# Altium schematic sheet reefpi_pico_toplevel.SchDoc: reef-pi Pico Top Level
size A4; DrawnBy: Yann Ramin; DocumentNumber: 1; Revision: D; SheetNumber: 1; SheetTotal: 8
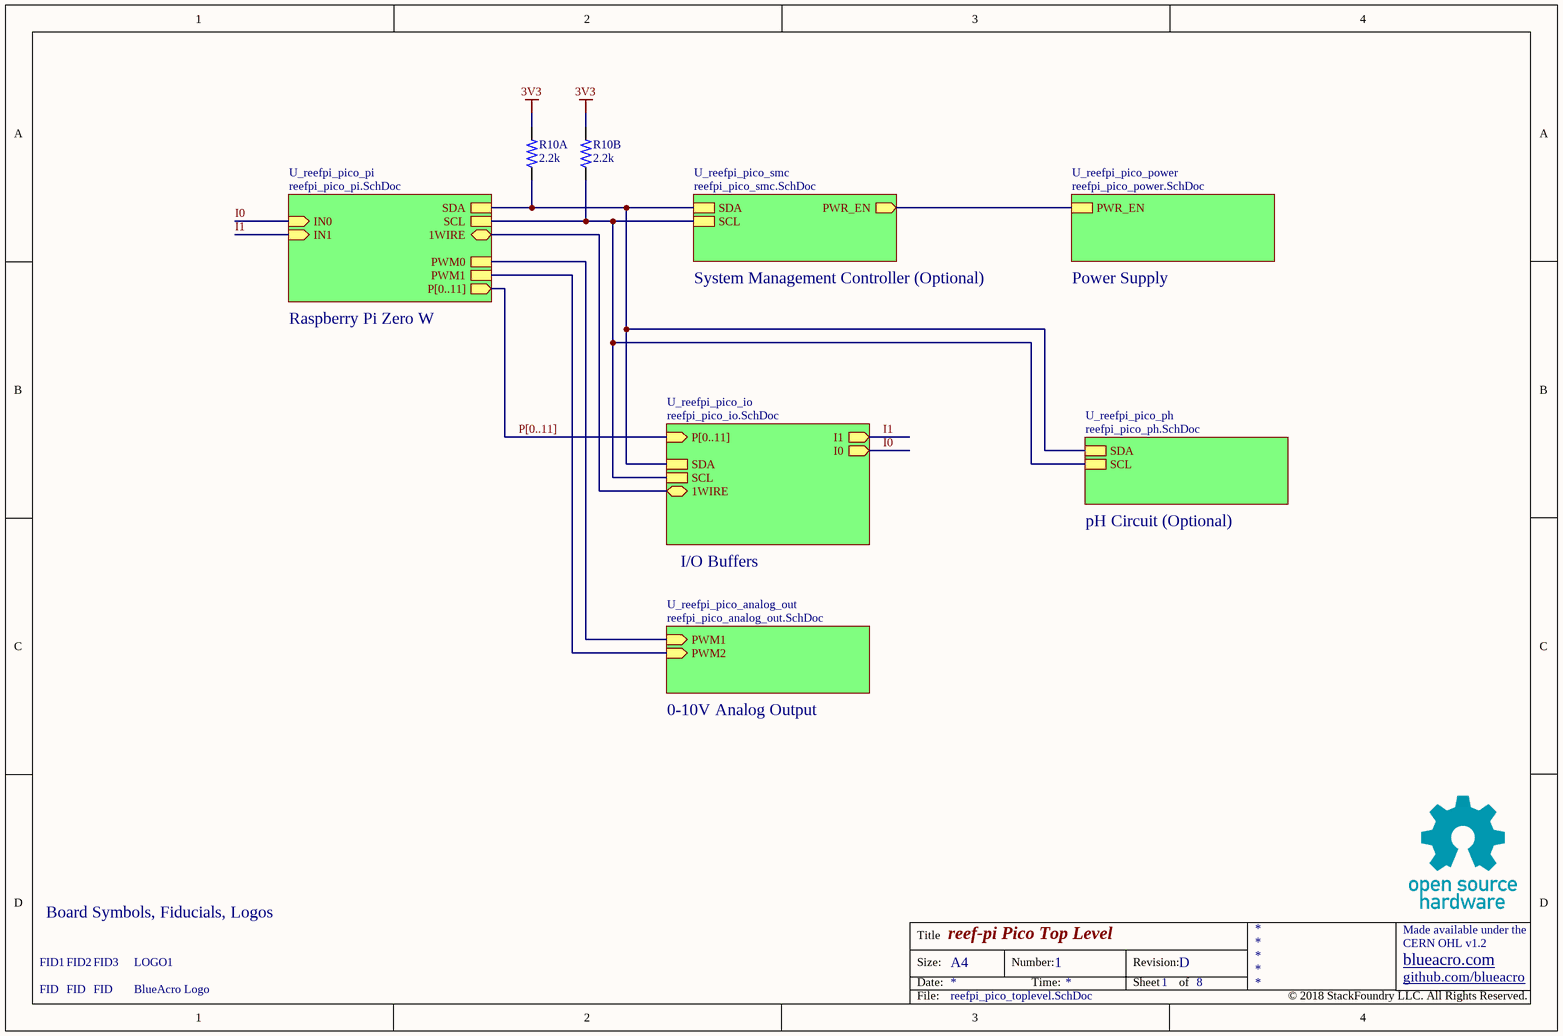
[diagram p0: reefpi_pico_toplevel.SchDoc]

## Parts
FID1  FID  [FIDUCIAL_1MM]
FID2  FID  [FIDUCIAL_1MM]
FID3  FID  [FIDUCIAL_1MM]
LOGO1  BlueAcro Logo  [BLUEACRO_LOGO_500MIL]
R10  2.2k  [R0603x4]  (parts A,B of 4)

## Sub-sheets
U_reefpi_pico_analog_out = reefpi_pico_analog_out.SchDoc: PWM1 (in), PWM2 (in)
U_reefpi_pico_io = reefpi_pico_io.SchDoc: P[0..11] (in), I1 (out), SDA, SCL, I0 (out), 1WIRE (bidir)
U_reefpi_pico_ph = reefpi_pico_ph.SchDoc: SDA, SCL
U_reefpi_pico_pi = reefpi_pico_pi.SchDoc: SDA, SCL, IN1 (in), IN0 (in), P[0..11] (out), 1WIRE (bidir), PWM1, PWM0
U_reefpi_pico_power = reefpi_pico_power.SchDoc: PWR_EN
U_reefpi_pico_smc = reefpi_pico_smc.SchDoc: SDA, SCL, PWR_EN (out)

## Nets
3V3: R10.2 R10.4
I0: sheet U_reefpi_pico_pi/IN0, sheet U_reefpi_pico_io/I0
I1: sheet U_reefpi_pico_pi/IN1, sheet U_reefpi_pico_io/I1
NetR10_1: R10.1 ; sheet U_reefpi_pico_pi/SDA, sheet U_reefpi_pico_smc/SDA, sheet U_reefpi_pico_io/SDA, sheet U_reefpi_pico_ph/SDA
NetR10_3: R10.3 ; sheet U_reefpi_pico_pi/SCL, sheet U_reefpi_pico_smc/SCL, sheet U_reefpi_pico_io/SCL, sheet U_reefpi_pico_ph/SCL
(unnamed): sheet U_reefpi_pico_power/PWR_EN, sheet U_reefpi_pico_smc/PWR_EN
(unnamed): sheet U_reefpi_pico_pi/1WIRE, sheet U_reefpi_pico_io/1WIRE
(unnamed): sheet U_reefpi_pico_pi/PWM1, sheet U_reefpi_pico_analog_out/PWM2
(unnamed): sheet U_reefpi_pico_pi/PWM0, sheet U_reefpi_pico_analog_out/PWM1

## Buses and harness runs
bus P[0..11] = sheet U_reefpi_pico_io/P[0..11] = sheet U_reefpi_pico_pi/P[0..11]

## Notes on the sheet
- System Management Controller (Optional)
- Power Supply
- Raspberry Pi Zero W
- I/O Buffers
- pH Circuit (Optional)
- 0-10V Analog Output
- Board Symbols, Fiducials, Logos
- Title
- Size:
- Date:
- A4
- Number:
- Time:
- Revision:
- Sheet
- of
- github.com/blueacro
- blueacro.com
- CERN OHL v1.2
- Made available under the
- File:
- © 2018 StackFoundry LLC. All Rights Reserved.

## Library data of the parts
R10 = R-US-4ch